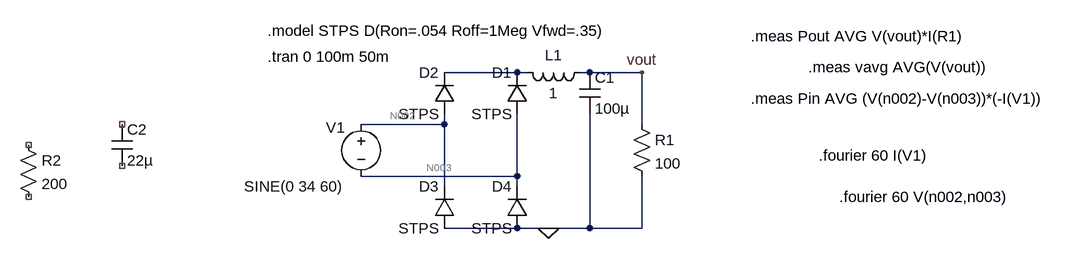
[diagram p0: schematic Rectifier.asc]
Rectifier.asc, the LTspice schematic file:
Version 4.1
SHEET 1 1300 680
WIRE 192 16 80 16
WIRE 208 16 192 16
WIRE 304 16 288 16
WIRE 384 16 304 16
WIRE 80 96 80 80
WIRE 80 96 -48 96
WIRE 384 96 384 16
WIRE 192 176 192 80
WIRE 192 176 -48 176
WIRE 80 192 80 96
WIRE 192 192 192 176
WIRE 192 256 80 256
WIRE 240 256 192 256
WIRE 304 256 304 80
WIRE 304 256 240 256
WIRE 384 256 384 176
WIRE 384 256 304 256
FLAG 240 256 0
FLAG 384 16 vout
SYMBOL voltage -48 80 R0
WINDOW 0 -54 21 Left 2
WINDOW 3 -180 112 Left 2
WINDOW 123 0 0 Left 0
WINDOW 39 0 0 Left 0
SYMATTR InstName V1
SYMATTR Value SINE(0 34 60)
SYMBOL res 368 80 R0
SYMATTR InstName R1
SYMATTR Value 100
SYMBOL diode 208 80 R180
WINDOW 0 24 64 Left 2
WINDOW 3 24 0 Left 2
SYMATTR InstName D1
SYMATTR Value STPS
SYMBOL diode 96 80 R180
WINDOW 0 24 64 Left 2
WINDOW 3 24 0 Left 2
SYMATTR InstName D2
SYMATTR Value STPS
SYMBOL diode 96 256 R180
WINDOW 0 24 64 Left 2
WINDOW 3 24 0 Left 2
SYMATTR InstName D3
SYMATTR Value STPS
SYMBOL diode 208 256 R180
WINDOW 0 24 64 Left 2
WINDOW 3 24 0 Left 2
SYMATTR InstName D4
SYMATTR Value STPS
SYMBOL cap 288 16 R0
SYMATTR InstName C1
SYMATTR Value 100µ
SYMBOL cap -432 96 R0
SYMATTR InstName C2
SYMATTR Value 22µ
SYMBOL ind 304 0 R90
WINDOW 0 5 56 VBottom 2
WINDOW 3 32 56 VTop 2
SYMATTR InstName L1
SYMATTR Value 1
SYMATTR SpiceLine Rser=41
SYMBOL res -576 112 R0
SYMATTR InstName R2
SYMATTR Value 200
TEXT -192 -48 Left 2 !.model STPS D(Ron=.054 Roff=1Meg Vfwd=.35)
TEXT -192 -8 Left 2 !.tran 0 100m 50m
TEXT 552 -40 Left 2 !.meas Pout AVG V(vout)*I(R1)
TEXT 552 56 Left 2 !.meas Pin AVG (V(n002)-V(n003))*(-I(V1))
TEXT 656 144 Left 2 !.fourier 60 I(V1)
TEXT 688 208 Left 2 !.fourier 60 V(n002,n003)
TEXT 640 8 Left 2 !.meas vavg AVG(V(vout))

The netlist it stands for:
* Rectifier.asc
V1 N002 N003 SINE(0 34 60)
R1 vout 0 100
D1 N003 N001 STPS
D2 N002 N001 STPS
D3 0 N002 STPS
D4 0 N003 STPS
C1 vout 0 100µ
C2 NC_01 NC_02 22µ
L1 vout N001 1 Rser=41
R2 NC_03 NC_04 200
.model D D
.lib standard.dio
.model STPS D(Ron=.054 Roff=1Meg Vfwd=.35)
.tran 0 100m 50m
.meas Pout AVG V(vout)*I(R1)
.meas Pin AVG (V(n002)-V(n003))*(-I(V1))
.fourier 60 I(V1)
.fourier 60 V(n002,n003)
.meas vavg AVG(V(vout))
.backanno
.end